# EAGLE design ConverterBoardRev2 (EAGLE 8.5.0)
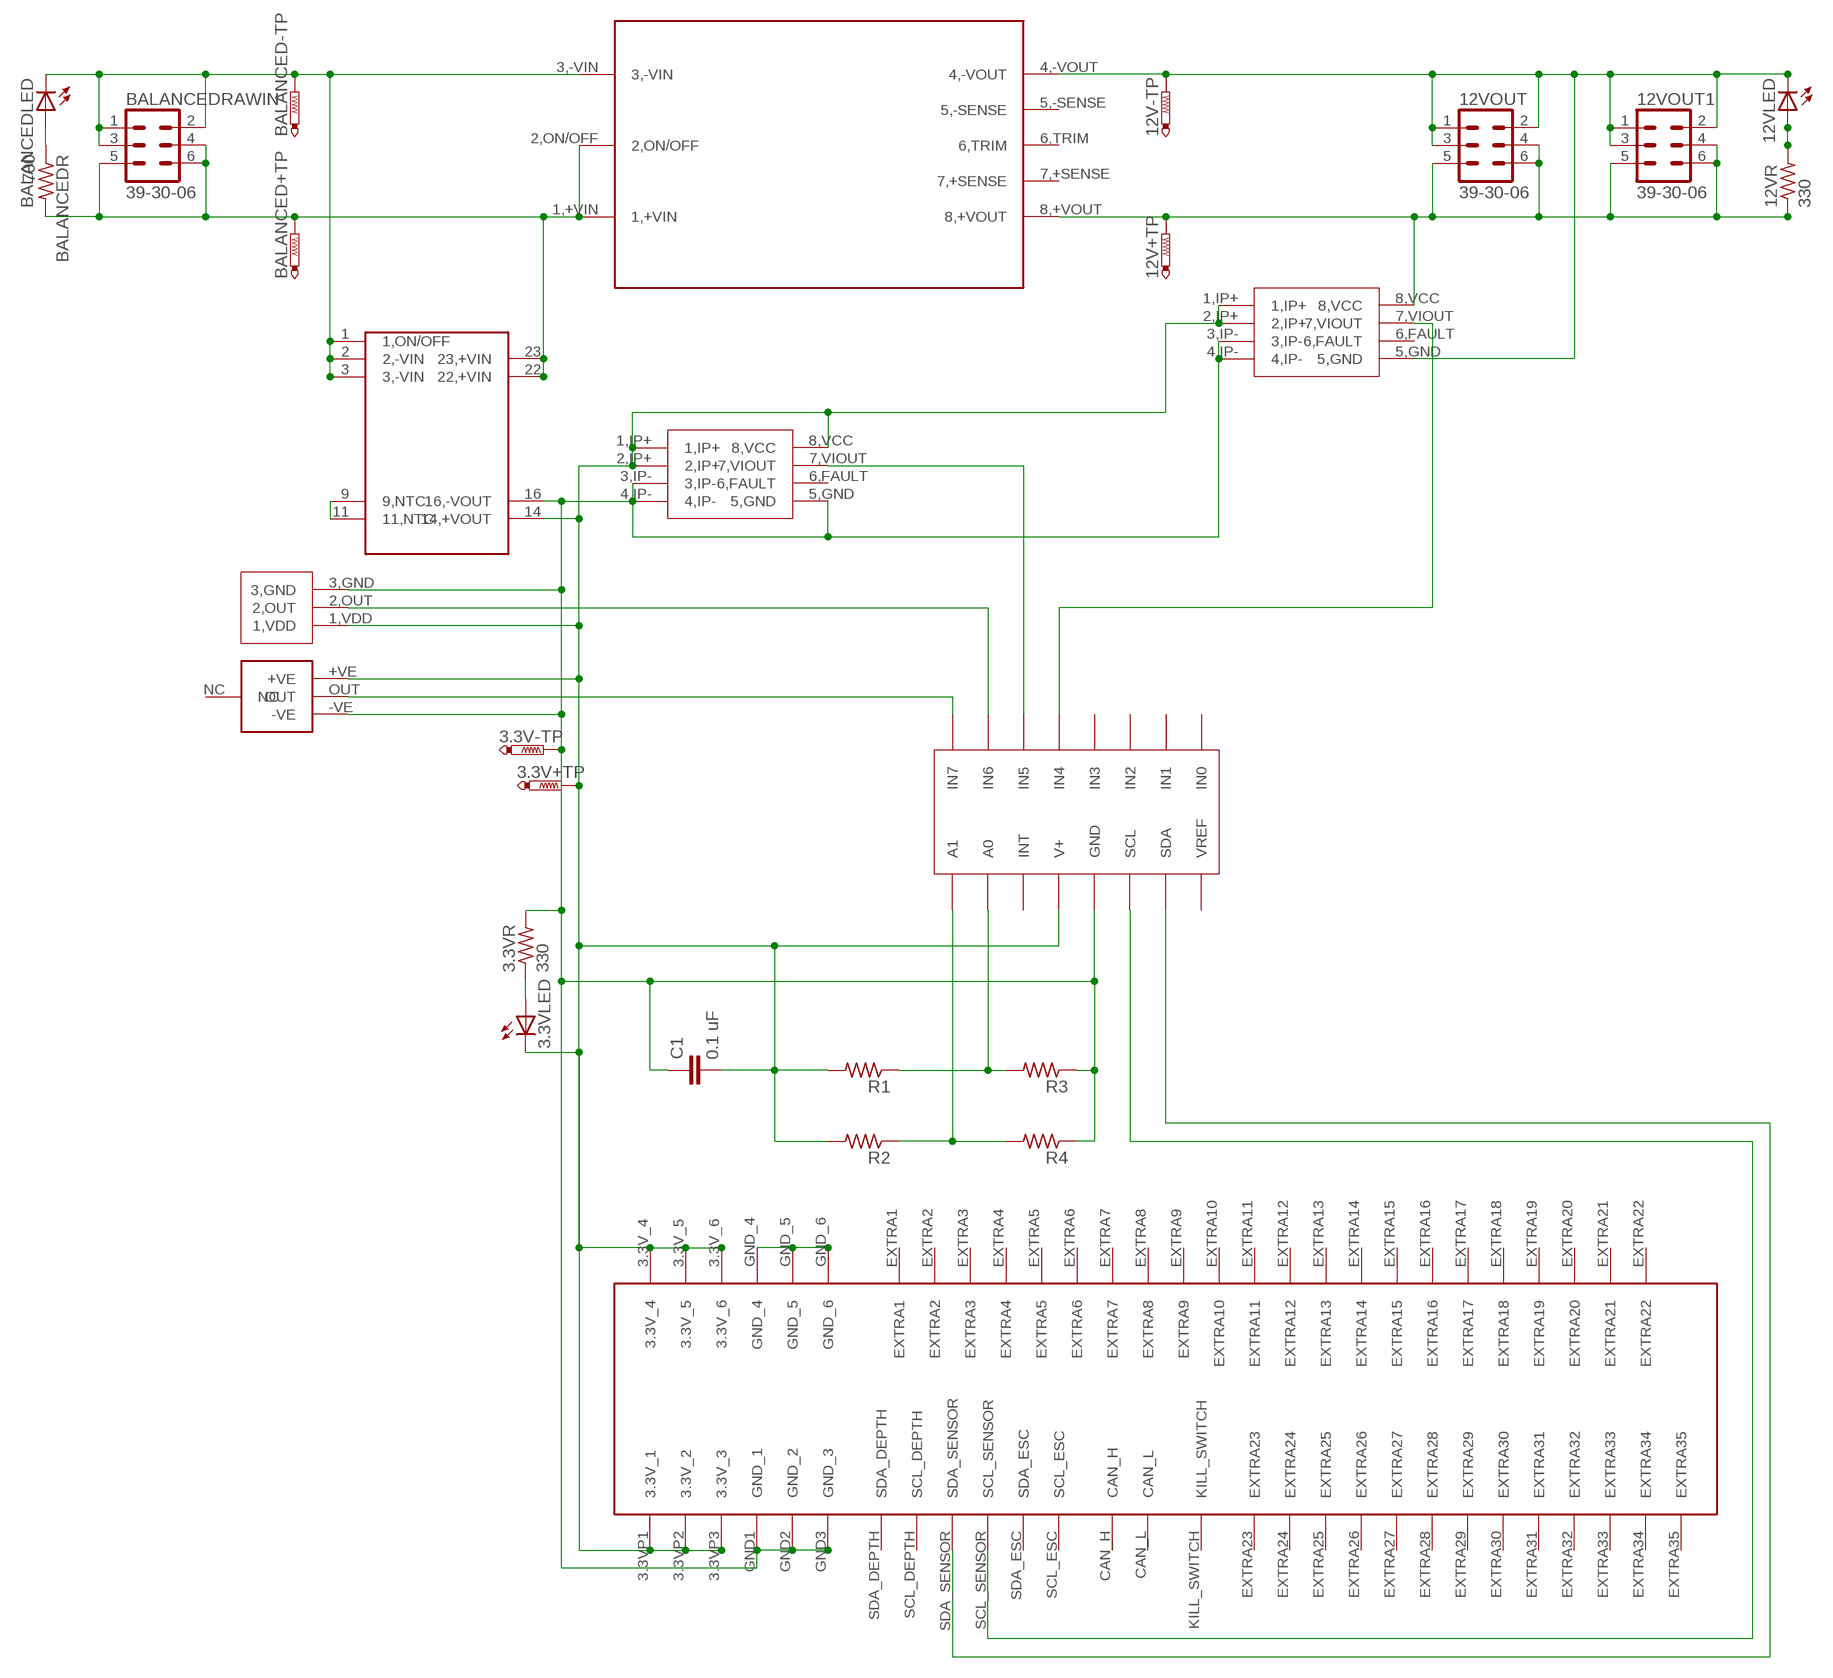
[diagram p0: schematic, sheet 1]

## Parts
3.3V+TP  PTR1B1,27  [B1,27]
3.3V-TP  PTR1B1,27  [B1,27]
3.3VLED  LTST-S270GKT  [LTST-S270GKT]
3.3VR  330  R-US_0204/7  [0204/7]
12V+TP  PTR1B1,27  [B1,27]
12V-TP  PTR1B1,27  [B1,27]
12VLED  LTST-S270GKT  [LTST-S270GKT]
12VOUT  39-30-06  [39-30-?06?]
12VOUT1  39-30-06  [39-30-?06?]
12VR  330  R-US_0204/7  [0204/7]
BALANCED+TP  PTR1B1,27  [B1,27]
BALANCED-TP  PTR1B1,27  [B1,27]
BALANCEDLED  LTST-S270GKT  [LTST-S270GKT]
BALANCEDR  700  R-US_0204/7  [0204/7]
BALANCEDRAWIN  39-30-06  [39-30-?06?]
C1  0.1 uF  C-EU025-024X044  [C025-024X044]
R1  R-US_0204/7  [0204/7]
R2  R-US_0204/7  [0204/7]
R3  R-US_0204/7  [0204/7]
R4  R-US_0204/7  [0204/7]
U$1  12VCONV  [12VCONV]
U$2  3.3VCONV  [3.3VCONV]
U$3  5530843  [5530843-6-BOARDFINGERS]
U$4  CURRENTSENS  [CURRENTSENS]
U$5  CURRENTSENS  [CURRENTSENS]
U$6  HUMIDITYSENSOR  [HUMIDITYSENSOR]
U$7  TEMPSENS  [TEMPSENS]
U$8  ADC128D818  [TSSOP-16]

## Nets
3.3V+: 3.3V+TP.TP 3.3VLED.CATHODE(C) C1.2 R1.2 R2.2 U$2.14(14,+VOUT) U$3.3.3V_4 U$3.3.3V_5 U$3.3.3V_6 U$3.3.3VP1(3.3V_1) U$3.3.3VP2(3.3V_2) U$3.3.3VP3(3.3V_3) U$4.1,IP+ U$4.2,IP+ U$5.1,IP+ U$5.2,IP+ U$5.8,VCC U$6.+VE U$7.1,VDD U$8.V+
3.3V-: 3.3V-TP.TP 3.3VR.2 C1.1 R3.1 R4.1 U$2.16(16,-VOUT) U$3.GND1(GND_1) U$3.GND2(GND_2) U$3.GND3(GND_3) U$4.3,IP- U$4.4,IP- U$5.3,IP- U$5.4,IP- U$5.5,GND U$6.-VE U$7.3,GND U$8.GND
3.3VLED: 3.3VLED.ANODE(A) 3.3VR.1
12V+: 12V+TP.TP 12VOUT1.4 12VOUT1.5 12VOUT1.6 12VOUT.4 12VOUT.5 12VOUT.6 12VR.1 U$1.8,+VOUT U$4.8,VCC
12V-: 12V-TP.TP 12VLED.CATHODE(C) 12VOUT1.1 12VOUT1.2 12VOUT1.3 12VOUT.1 12VOUT.2 12VOUT.3 U$1.4,-VOUT U$4.5,GND
12VLED: 12VLED.ANODE(A) 12VR.2
BALANCED+: BALANCED+TP.TP BALANCEDR.2 BALANCEDRAWIN.4 BALANCEDRAWIN.5 BALANCEDRAWIN.6 U$1.1,+VIN U$1.2,ON/OFF U$2.22(22,+VIN) U$2.23(23,+VIN)
BALANCED-: BALANCED-TP.TP BALANCEDLED.CATHODE(C) BALANCEDRAWIN.1 BALANCEDRAWIN.2 BALANCEDRAWIN.3 U$1.3,-VIN U$2.1(1,ON/OFF) U$2.2(2,-VIN) U$2.3(3,-VIN)
BALANCEDLED: BALANCEDLED.ANODE(A) BALANCEDR.1
HUMIDITYDATA: U$6.OUT U$8.IN7
N$1: U$2.9(9,NTC) U$2.11(11,NTC)
N$2: U$5.7,VIOUT U$8.IN5
N$3: U$4.7,VIOUT U$8.IN4
N$4: U$3.GND_4 U$3.GND_5 U$3.GND_6
N$5: R1.1 R3.2 U$8.A0
N$6: R2.1 R4.2 U$8.A1
N$7: U$3.SCL_SENSOR U$8.SCL
N$8: U$3.SDA_SENSOR U$8.SDA
TEMPDATA: U$7.2,OUT U$8.IN6
Unconnected: U$1.5,-SENSE U$1.6,TRIM U$1.7,+SENSE U$3.CAN_H U$3.CAN_L U$3.EXTRA1 U$3.EXTRA2 U$3.EXTRA3 U$3.EXTRA4 U$3.EXTRA5 U$3.EXTRA6 U$3.EXTRA7 U$3.EXTRA8 U$3.EXTRA9 U$3.EXTRA10 U$3.EXTRA11 U$3.EXTRA12 U$3.EXTRA13 U$3.EXTRA14 U$3.EXTRA15 U$3.EXTRA16 U$3.EXTRA17 U$3.EXTRA18 U$3.EXTRA19 U$3.EXTRA20 U$3.EXTRA21 U$3.EXTRA22 U$3.EXTRA23 U$3.EXTRA24 U$3.EXTRA25 U$3.EXTRA26 U$3.EXTRA27 U$3.EXTRA28 U$3.EXTRA29 U$3.EXTRA30 U$3.EXTRA31 U$3.EXTRA32 U$3.EXTRA33 U$3.EXTRA34 U$3.EXTRA35 U$3.KILL_SWITCH U$3.SCL_DEPTH U$3.SCL_ESC U$3.SDA_DEPTH U$3.SDA_ESC U$4.6,FAULT U$5.6,FAULT U$6.NC U$8.IN0 U$8.IN1 U$8.IN2 U$8.IN3 U$8.INT U$8.VREF

## Library data of the parts
3.3V+TP 3.3V-TP 12V+TP 12V-TP BALANCED+TP BALANCED-TP = testpad:PTR1: TEST PIN
3.3VLED 12VLED BALANCEDLED = LTST-S270GKT:LTST-S270GKT
3.3VR 12VR BALANCEDR R1-R4 = resistor:R-US_: RESISTOR, American symbol
12VOUT 12VOUT1 BALANCEDRAWIN = con-molex-mini-fit:39-30-?06?: HEADER
C1 = resistor:C-EU: CAPACITOR, European symbol
U$1 = 12VCONV:12VCONV
U$2 = 3.3V Converter:3.3VCONV
U$3 = 5530843-6:5530843
U$4 U$5 = CurrentSensor:CURRENTSENS
U$6 = HumiditySensor:HUMIDITYSENSOR
U$7 = TemperatureSensor:TEMPSENS
U$8 = ADC128D818:ADC128D818

## Board
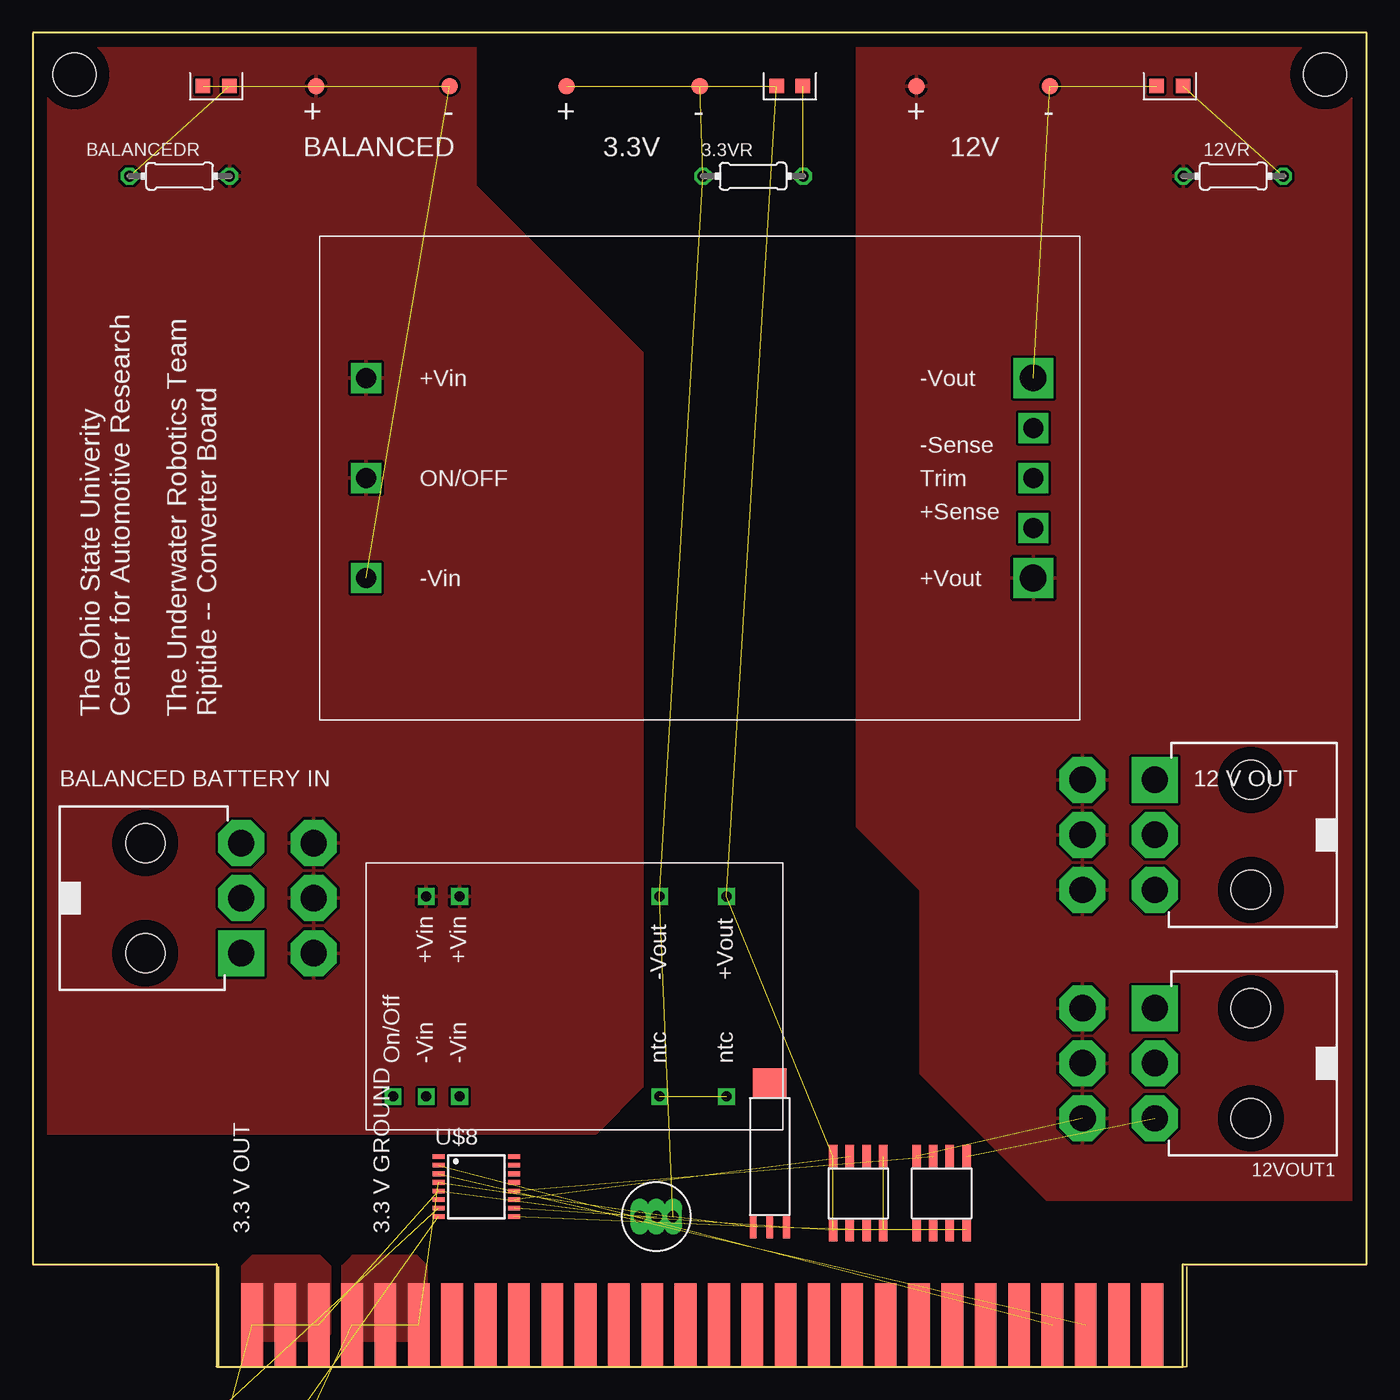
[diagram p1: board, top side]
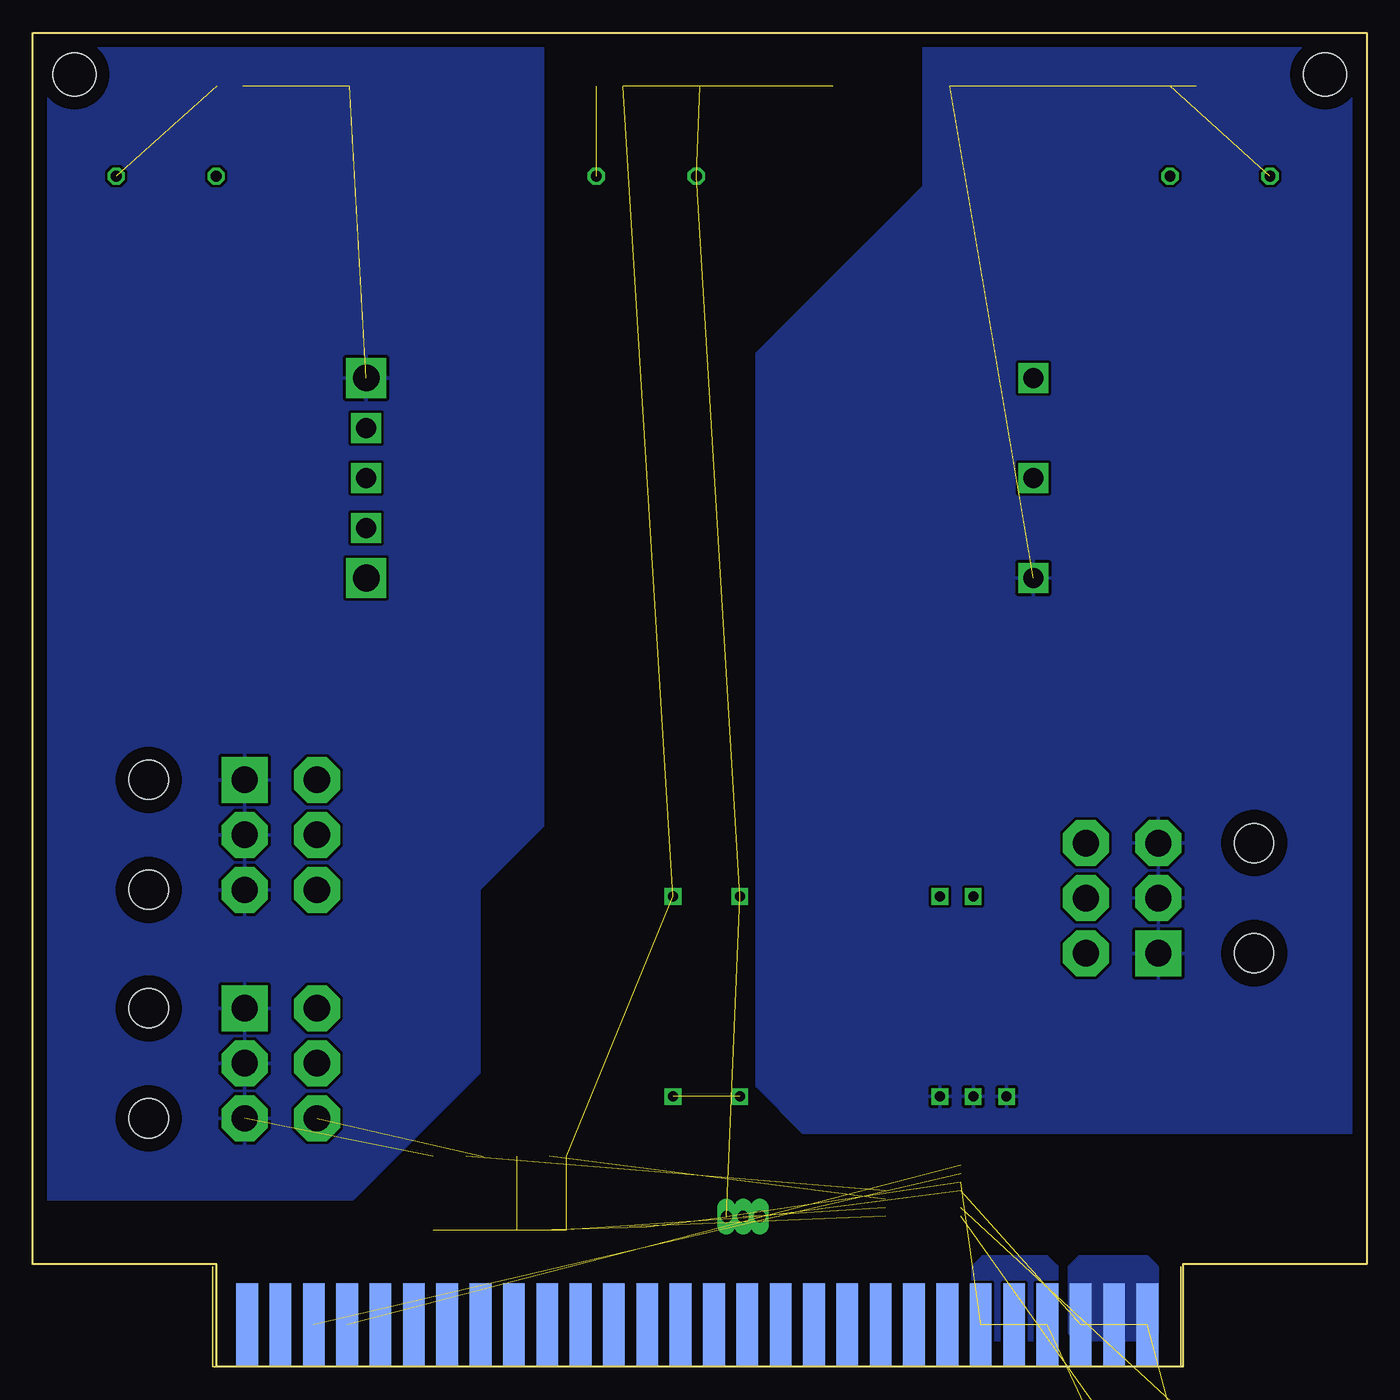
[diagram p2: board, bottom side, seen from below]

Size 101.6 x 101.6 mm. Coordinates in mm from the lower left corner, seen from the top.
Outline: 14,0 87.6,0 87.6,7.8 101.6,7.8 101.6,101.6 0,101.6 0,7.8 14,7.8 14,0
Copper layers (1*16): Top 0.035mm / dielectric 1.5mm / Bottom 0.035mm
Design rules "battery_balancer": minimum track width 6mil, minimum drill 0.35mm, track to track 0.205mm, track to pad 0.205mm, pad to pad 0.205mm, via to via 0.205mm, smd to smd 6mil, copper to edge 40mil, drill to drill 6mil, minimum pad ring 10mil, minimum via ring 8mil, stop-mask expansion 4mil, vias tented up to drill 0mil, thermal gap 10mil
Holes 3.26 mm at 3.17,98.42 98.42,98.42

### Footprints (pad centres in the part's own frame; a part is rotated, then mirrored left to right if it is on the bottom)
B1,27 = smd 1.27 x 1.27: TP 0,0
LTST-S270GKT = smd 1.1 x 1.1: ANODE 1,0; CATHODE -1,0
0204/7 = drill 0.813 octagon: 1 -3.81,0; 2 3.81,0
39-30-?06? = drill 2 pad 3.5 square: 1 4.191,0 | drill 2 pad 3.5 octagon: 2 0,0; 3 -4.191,0; 4 4.191,5.512; 5 0,5.512; 6 -4.191,5.512 | hole 3: -4.191,-7.3; 4.191,-7.3
C025-024X044 = drill 0.813 octagon: 1 -1.27,0; 2 1.27,0
12VCONV = drill 1.524 square: 1,+VIN 3.556,26.035; 2,ON/OFF 3.556,18.415; 3,-VIN 3.556,10.795; 5,-SENSE 54.356,22.225; 6,TRIM 54.356,18.415; 7,+SENSE 54.356,14.605 | drill 2.032 square: 4,-VOUT 54.356,26.035; 8,+VOUT 54.356,10.795
3.3VCONV = drill 0.762 square: 1 2.54,29.718; 2 2.54,27.178; 3 2.54,24.638; 9 2.54,9.398; 11 2.54,4.318; 14 17.78,4.318; 16 17.78,9.398; 22 17.78,24.638; 23 17.78,27.178
5530843-6-BOARDFINGERS = smd 1.651 x 6.35 bottom: 3.3V_4 0.826,3.175; 3.3V_5 3.365,3.175; 3.3V_6 5.905,3.175; EXTRA1 16.066,3.175; EXTRA2 18.605,3.175; EXTRA3 21.145,3.175; EXTRA4 23.686,3.175; EXTRA5 26.226,3.175; EXTRA6 28.765,3.175; EXTRA7 31.305,3.175; EXTRA8 33.846,3.175; EXTRA9 36.386,3.175; EXTRA10 38.925,3.175; EXTRA11 41.465,3.175; EXTRA12 44.005,3.175; EXTRA13 46.545,3.175; EXTRA14 49.086,3.175; EXTRA15 51.626,3.175; EXTRA16 54.166,3.175; EXTRA17 56.706,3.175; EXTRA18 59.245,3.175; EXTRA19 61.785,3.175; EXTRA20 64.326,3.175; EXTRA21 66.865,3.175; EXTRA22 69.406,3.175; GND_4 8.445,3.175; GND_5 10.986,3.175; GND_6 13.525,3.175 | smd 1.651 x 6.35: 3.3VP1 0.826,3.175; 3.3VP2 3.365,3.175; 3.3VP3 5.905,3.175; CAN_H 51.626,3.175; CAN_L 54.166,3.175; EXTRA23 16.066,3.175; EXTRA24 18.605,3.175; EXTRA25 21.145,3.175; EXTRA26 23.686,3.175; EXTRA27 26.226,3.175; EXTRA28 28.765,3.175; EXTRA29 31.305,3.175; EXTRA30 33.846,3.175; EXTRA31 36.386,3.175; EXTRA32 38.925,3.175; EXTRA33 41.465,3.175; EXTRA34 44.005,3.175; EXTRA35 46.545,3.175; GND1 8.445,3.175; GND2 10.986,3.175; GND3 13.525,3.175; KILL_SWITCH 49.086,3.175; SCL_DEPTH 59.245,3.175; SCL_ESC 69.406,3.175; SCL_SENSOR 64.326,3.175; SDA_DEPTH 56.706,3.175; SDA_ESC 66.865,3.175; SDA_SENSOR 61.785,3.175
CURRENTSENS = smd 0.65 x 1.75: 1,IP+ 0,0; 2,IP+ 1.27,0; 3,IP- 2.54,0; 4,IP- 3.81,0; 5,GND 3.81,5.6; 6,FAULT 2.54,5.6; 7,VIOUT 1.27,5.6; 8,VCC 0,5.6
HUMIDITYSENSOR = smd 0.51 x 1.78: +VE 2.54,0; -VE 0,0; OUT 1.27,0 | smd 2.54 x 2.29: NC 1.27,10.925
TEMPSENS = drill 0.85 pad 1.016 long: 1,VDD 0,0; 2,OUT 1.27,0; 3,GND 2.54,0
TSSOP-16 = smd 0.9 x 0.35: A0 -2.875,-1.625; A1 -2.875,-2.275; GND -2.875,0.325; IN0 2.875,2.275; IN1 2.875,1.625; IN2 2.875,0.975; IN3 2.875,0.325; IN4 2.875,-0.325; IN5 2.875,-0.975; IN6 2.875,-1.625; IN7 2.875,-2.275; INT -2.875,-0.975; SCL -2.875,0.975; SDA -2.875,1.625; V+ -2.875,-0.325; VREF -2.875,2.275

### Placement (x,y rotation side)
3.3V+TP  40.64,97.54 0 top
3.3V-TP  50.8,97.54 0 top
3.3VLED  57.66,97.54 0 top
3.3VR  54.86,90.68 180 top
12V+TP  67.31,97.54 0 top
12V-TP  77.47,97.54 0 top
12VLED  86.61,97.54 0 top
12VOUT  39-30-06?  [39-30-?06?]  85.47,40.51 90 top
12VOUT1  39-30-06?  [39-30-?06?]  85.47,23.11 90 top
12VR  91.44,90.68 0 top
BALANCED+TP  21.59,97.54 0 top
BALANCED-TP  31.75,97.54 0 top
BALANCEDLED  13.97,97.54 0 top
BALANCEDR  11.18,90.68 0 top
BALANCEDRAWIN  39-30-06?  [39-30-?06?]  15.88,35.69 270 top
C1  6.35,-64.52 0 top  (outside the outline)
R1  8.89,-11.68 0 top  (outside the outline)
R2  8.89,-24.89 0 top  (outside the outline)
R3  8.89,-38.1 0 top  (outside the outline)
R4  8.89,-51.31 0 top  (outside the outline)
U$1  21.84,49.28 0 top
U$2  57.15,18.03 90 top
U$3  15.88,0 0 top
U$4  67.31,10.41 0 top
U$5  60.96,10.41 0 top
U$6  54.86,10.67 0 top
U$7  46.23,11.43 0 top
U$8  33.78,13.72 0 top

### Tracks (layer width: path | path; a pad name or v marks a point on that pad's centre or on a via)
3.3V+  (19 unrouted)
  pour Bottom (no thermals): 16,7.37 16,2.54 16.51,2.03 22.1,2.03 22.61,2.54 22.61,7.62 21.84,8.38 16.76,8.38 16,7.62
  pour Top (no thermals): 16.76,8.38 16,7.62 16,2.54 16.51,2.03 21.59,2.03 22.1,2.03 22.61,2.54 22.61,7.62 21.84,8.38 17.02,8.38
3.3V-  (16 unrouted)
  pour Top (no thermals): 23.62,2.79 23.62,2.54 24.13,2.03 29.46,2.03 29.97,2.54 29.97,7.62 29.21,8.38 24.38,8.38 23.62,7.62
  pour Bottom: 23.62,2.54 24.13,2.03 29.46,2.03 29.97,2.54 29.97,7.62 29.21,8.38 24.64,8.38 24.38,8.38 23.62,7.62
  pour Bottom (no thermals): 24.38,8.38 23.62,7.62 23.62,2.54 24.13,2.03 28.96,2.03 29.21,2.03 29.97,2.79 29.97,7.62 29.21,8.38
3.3VLED  (1 unrouted)
12V+  (1 unrouted)
  pour Top: 62.74,101.6 62.74,41.15 67.56,36.32 67.56,22.35 77.22,12.7 101.35,12.7 101.6,12.95 101.6,101.35 101.35,101.6
12V-  (3 unrouted)
  pour Bottom: 62.74,101.6 62.74,41.15 67.56,36.32 67.56,35.81 67.56,22.35 77.22,12.7 101.6,12.7 101.6,101.6
12VLED  (1 unrouted)
BALANCED+
  pour Top: 0,101.6 0,17.78 42.93,17.78 46.48,21.34 46.48,77.22 33.78,89.92 33.78,101.6
BALANCED-  (2 unrouted)
  pour Bottom: 0,101.6 0,17.78 42.93,17.78 46.48,21.34 46.48,77.22 33.78,89.92 33.78,101.6
BALANCEDLED  (1 unrouted)
HUMIDITYDATA  (1 unrouted)
N$1  (1 unrouted)
N$2  (1 unrouted)
N$3  (1 unrouted)
N$4  (2 unrouted)
N$5  (2 unrouted)
N$6  (2 unrouted)
N$7  (1 unrouted)
N$8  (1 unrouted)
TEMPDATA  (1 unrouted)

### Text on the board
tPlace: + | - | + | - | + | - | BALANCED | 3.3V | 12V | The Ohio State Univerity / Center for Automotive Research | The Underwater Robotics Team / Riptide -- Converter Board | BALANCED BATTERY IN | 12 V OUT | 3.3 V OUT | 3.3 V GROUND